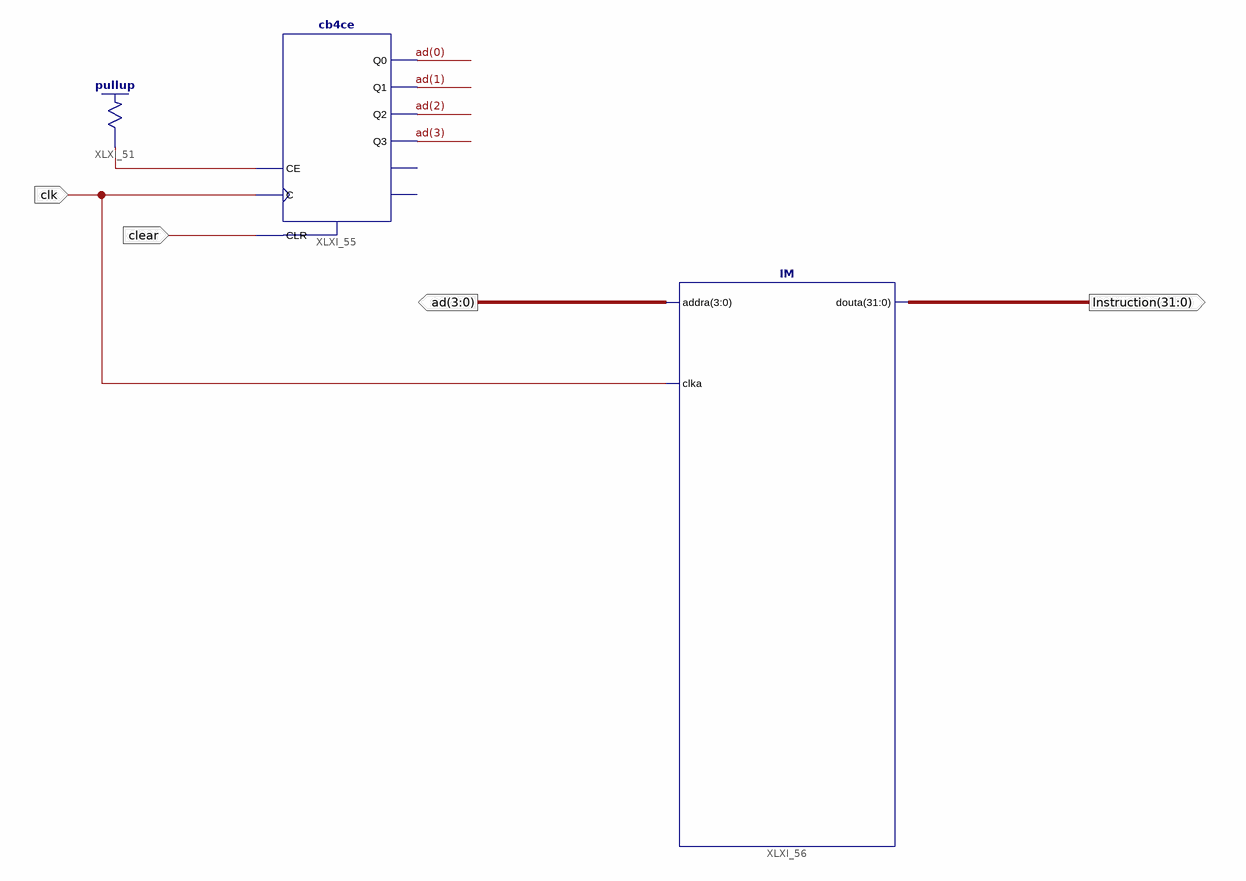
[diagram p0: schematic sheet 1]
// Xilinx ISE schematic Fetch.sch (spartan6) as structural Verilog: 3 symbols, 4 ports
module Fetch (
  input  clear,
  input  clk,
  output [3:0] ad,
  output [31:0] Instruction
);

  wire XLXN_58;

  IM XLXI_56 (.addra(ad), .clka(clk), .douta(Instruction));
  cb4ce XLXI_55 (.C(clk), .CE(XLXN_58), .CLR(clear), .Q0(ad[0]), .Q1(ad[1]), .Q2(ad[2]), .Q3(ad[3]));  // open: CEO, TC
  \pullup  XLXI_51 (.O(XLXN_58));
endmodule
